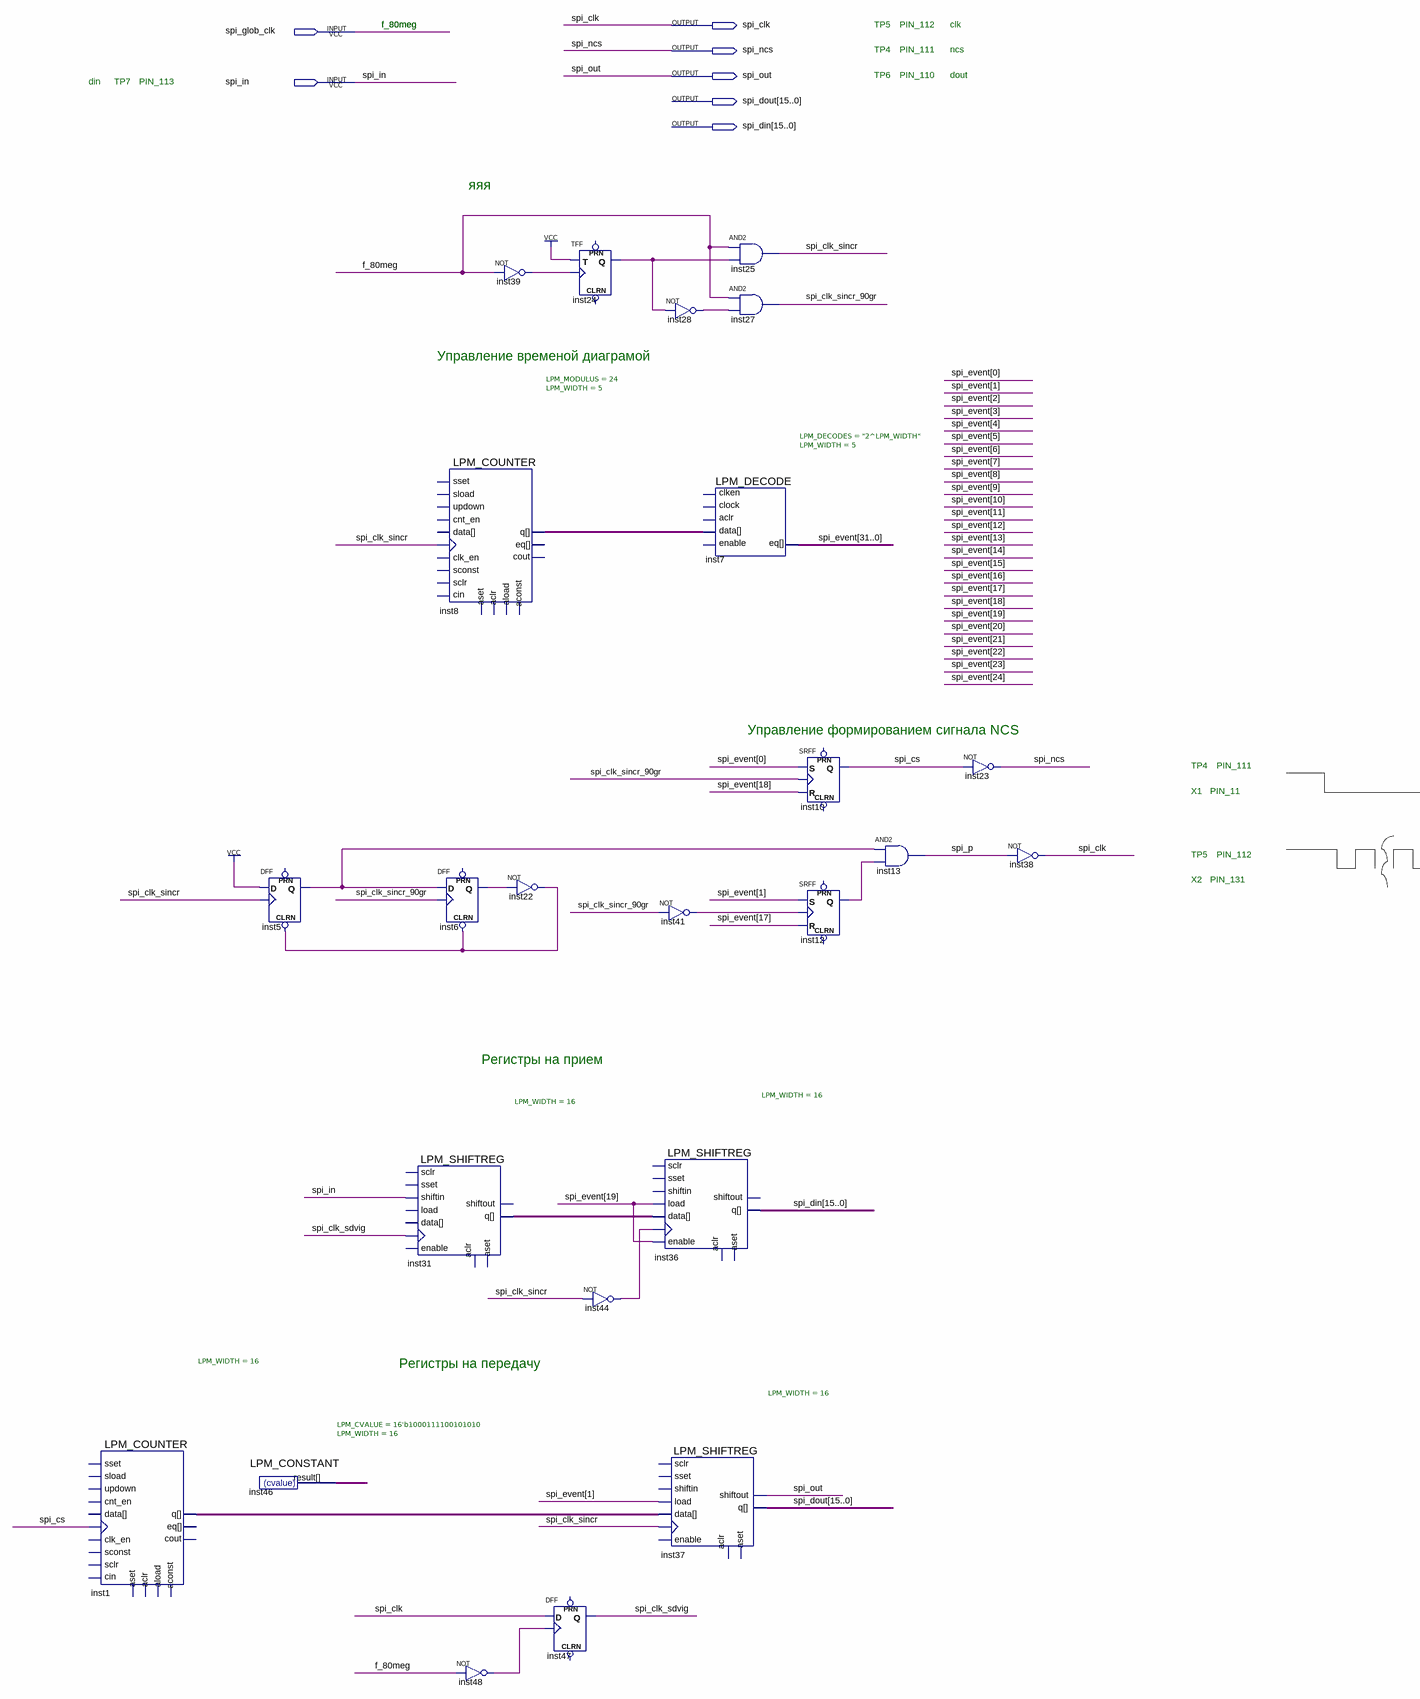
[diagram p0: schematic sheet]
// Quartus schematic sss_spi_discovery.bdf as structural Verilog: 24 symbols, 7 pins
module sss_spi_discovery (
  input  spi_glob_clk,
  input  spi_in,
  output spi_clk,
  output spi_ncs,
  output spi_out,
  output [15:0] spi_dout,
  output [15:0] spi_din
);

  wire inst5_q, inst6_q, inst12_q, inst22_out, inst24_q, inst28_out, inst39_out, inst41_out, inst44_out,
       inst48_out, spi_clk_sdvig, spi_clk_sincr, spi_clk_sincr_90gr, spi_cs, spi_p;
  wire [4:0] inst8_q;
  wire [15:0] inst1_q, inst31_q, inst46_result;
  wire [31:0] spi_event;

  LPM_COUNTER #(.LPM_WIDTH(16)) inst1 (
    .clock(spi_cs), .q(inst1_q));  // open: sset, sload, updown, cnt_en, data, clk_en, sconst, sclr, aload, aclr, aset, aconst, cin, eq, cout
  LPM_CONSTANT #(.LPM_CVALUE(16'b1000111100101010), .LPM_WIDTH(16)) inst46 (.result(inst46_result));
  DFF inst5 (.CLRN(inst22_out), .CLK(spi_clk_sincr), .D(1'b1), .Q(inst5_q));  // open: PRN
  LPM_COUNTER #(.LPM_MODULUS(24), .LPM_WIDTH(5)) inst8 (
    .clock(spi_clk_sincr), .q(inst8_q));  // open: sset, sload, updown, cnt_en, data, clk_en, sconst, sclr, aload, aclr, aset, aconst, cin, eq, cout
  DFF inst6 (.CLRN(inst22_out), .CLK(spi_clk_sincr_90gr), .D(inst5_q), .Q(inst6_q));  // open: PRN
  LPM_SHIFTREG #(.LPM_WIDTH(16)) inst31 (
    .shiftin(spi_in), .clock(spi_clk_sdvig), .q(inst31_q));  // open: sset, enable, data, load, sclr, aset, aclr, shiftout
  not inst39 (inst39_out, spi_glob_clk);
  not inst48 (inst48_out, spi_glob_clk);
  not inst22 (inst22_out, inst6_q);
  DFF inst47 (.CLK(inst48_out), .D(spi_clk), .Q(spi_clk_sdvig));  // open: CLRN, PRN
  TFF inst24 (.T(1'b1), .CLK(inst39_out), .Q(inst24_q));  // open: PRN, CLRN
  not inst44 (inst44_out, spi_clk_sincr);
  LPM_SHIFTREG #(.LPM_WIDTH(16)) inst36 (
    .enable(spi_event[19]), .clock(inst44_out), .data(inst31_q), .load(spi_event[19]), .q(spi_din));  // open: shiftin, sset, sclr, aset, aclr, shiftout
  not inst28 (inst28_out, inst24_q);
  LPM_DECODE #(.LPM_DECODES("2^LPM_WIDTH"), .LPM_WIDTH(5)) inst7 (
    .data(inst8_q), .eq(spi_event));  // open: enable, clken, clock, aclr
  not inst41 (inst41_out, spi_clk_sincr_90gr);
  LPM_SHIFTREG #(.LPM_WIDTH(16)) inst37 (
    .clock(spi_clk_sincr), .data(inst1_q), .load(spi_event[1]), .shiftout(spi_out), .q(spi_dout));  // open: shiftin, sset, enable, sclr, aset, aclr
  and inst25 (spi_clk_sincr, spi_glob_clk, inst24_q);
  and inst27 (spi_clk_sincr_90gr, spi_glob_clk, inst28_out);
  SRFF inst10 (.S(spi_event[0]), .R(spi_event[18]), .CLK(spi_clk_sincr_90gr), .Q(spi_cs));  // open: PRN, CLRN
  SRFF inst12 (.S(spi_event[1]), .R(spi_event[17]), .CLK(inst41_out), .Q(inst12_q));  // open: PRN, CLRN
  and inst13 (spi_p, inst5_q, inst12_q);
  not inst23 (spi_ncs, spi_cs);
  not inst38 (spi_clk, spi_p);

  // Other names for the same wires on the sheet: f_80meg = spi_glob_clk

  // Notes on the sheet:
  //   f_80meg
  //   TP5
  //   PIN_112
  //   clk
  //   TP4
  //   PIN_111
  //   ncs
  //   TP6
  //   PIN_110
  //   dout
  //   din
  //   TP7
  //   PIN_113
  //   яяя
  //   Управление временой диаграмой
  //   Управление формированием сигнала NCS
  //   TP4
  //   PIN_111
  //   X1
  //   PIN_11
  //   TP5
  //   PIN_112
  //   X2
  //   PIN_131
  //   Регистры на прием
  //   Регистры на передачу
endmodule
